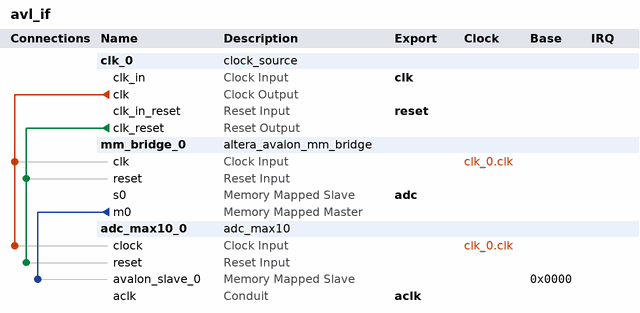
[diagram p0: system contents]
# Platform Designer (Qsys) system avl_if, MAX 10 10M50SAE144C8G
# Parameters at their usual value, and those the tool derives, are not listed.
package require -exact qsys 18.0
create_system avl_if
set_project_property DEVICE_FAMILY {MAX 10}
set_project_property DEVICE 10M50SAE144C8G

add_instance clk_0 clock_source 18.0
set_instance_parameter_value clk_0 clockFrequency 100000000

add_instance mm_bridge_0 altera_avalon_mm_bridge 18.0
set_instance_parameter_value mm_bridge_0 ADDRESS_UNITS WORDS
set_instance_parameter_value mm_bridge_0 ADDRESS_WIDTH 10
set_instance_parameter_value mm_bridge_0 DATA_WIDTH 16
set_instance_parameter_value mm_bridge_0 MAX_PENDING_RESPONSES 64
set_instance_parameter_value mm_bridge_0 USE_AUTO_ADDRESS_WIDTH 0

add_instance adc_max10_0 adc_max10 1.0

# connections
add_connection clk_0.clk adc_max10_0.clock clock
add_connection clk_0.clk mm_bridge_0.clk clock
add_connection clk_0.clk_reset adc_max10_0.reset reset
add_connection clk_0.clk_reset mm_bridge_0.reset reset
add_connection mm_bridge_0.m0 adc_max10_0.avalon_slave_0 avalon
set_connection_parameter_value mm_bridge_0.m0/adc_max10_0.avalon_slave_0 baseAddress 0x0000

# exported interfaces
add_interface aclk conduit end
set_interface_property aclk EXPORT_OF adc_max10_0.aclk
add_interface adc avalon slave
set_interface_property adc EXPORT_OF mm_bridge_0.s0
add_interface clk clock sink
set_interface_property clk EXPORT_OF clk_0.clk_in
add_interface reset reset sink
set_interface_property reset EXPORT_OF clk_0.clk_in_reset

set_interconnect_requirement {$system} qsys_mm.clockCrossingAdapter HANDSHAKE
set_interconnect_requirement {$system} qsys_mm.enableEccProtection FALSE
set_interconnect_requirement {$system} qsys_mm.insertDefaultSlave FALSE
set_interconnect_requirement {$system} qsys_mm.maxAdditionalLatency 1

save_system avl_if.qsys
